# Altium schematic sheet tie-il34-il07-mid.SchDoc: Copper Suicide - Net Tie 34:07:M
size Letter; CheckedBy: E. Chiu; CompanyName: Signal Laboratories, Inc.; DrawnBy: J. Brinton; Engineer: J. Brinton; Address1: 3479 Edison Way; Address2: Menlo Park CA 94025; Address3: +1 (877) 778-8435; Address4: siglabs.com; Revision: 1; SheetNumber: 29; SheetTotal: 47
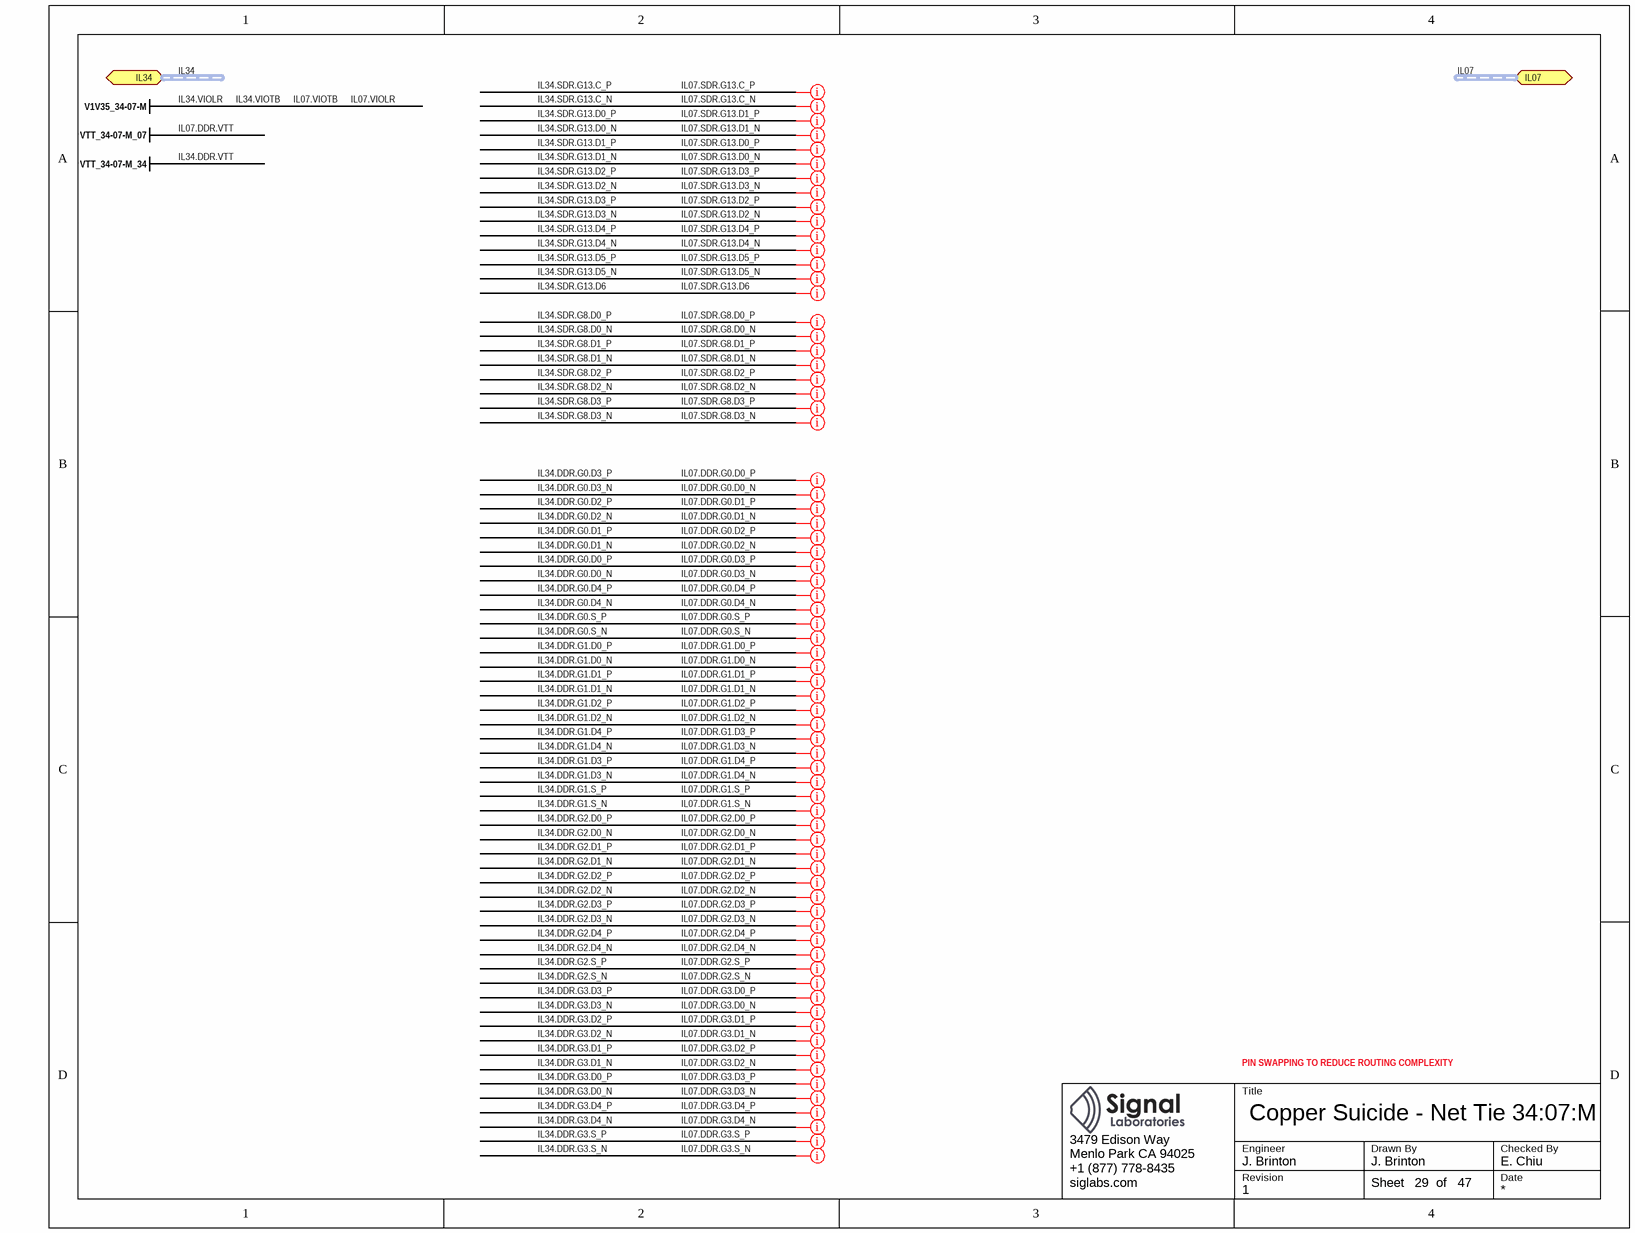
[diagram p0: tie-il34-il07-mid.SchDoc]

## Ports
IL07 (harness IL-1V35), IL34 (harness IL-1V35)

## Buses and harness runs
harness IL07 = port IL07
harness IL34 = port IL34

## Layout directives
net class z50: IL07.SDR.G13.D6
net class z50; differential pair; net class loose: IL07.DDR.G0.D0_N, IL07.DDR.G0.D0_P, IL07.DDR.G0.D1_N, IL07.DDR.G0.D1_P, IL07.DDR.G0.D2_N, IL07.DDR.G0.D2_P, IL07.DDR.G0.D3_N, IL07.DDR.G0.D3_P, IL07.DDR.G0.D4_N, IL07.DDR.G0.D4_P, IL07.DDR.G0.S_N, IL07.DDR.G0.S_P, IL07.DDR.G1.D0_N, IL07.DDR.G1.D0_P, IL07.DDR.G1.D1_N, IL07.DDR.G1.D1_P, IL07.DDR.G1.D2_N, IL07.DDR.G1.D2_P, IL07.DDR.G1.D3_N, IL07.DDR.G1.D3_P, IL07.DDR.G1.D4_N, IL07.DDR.G1.D4_P, IL07.DDR.G1.S_N, IL07.DDR.G1.S_P, IL07.DDR.G2.D0_N, IL07.DDR.G2.D0_P, IL07.DDR.G2.D1_N, IL07.DDR.G2.D1_P, IL07.DDR.G2.D2_N, IL07.DDR.G2.D2_P, IL07.DDR.G2.D3_N, IL07.DDR.G2.D3_P, IL07.DDR.G2.D4_N, IL07.DDR.G2.D4_P, IL07.DDR.G2.S_N, IL07.DDR.G2.S_P, IL07.DDR.G3.D0_N, IL07.DDR.G3.D0_P, IL07.DDR.G3.D1_N, IL07.DDR.G3.D1_P, IL07.DDR.G3.D2_N, IL07.DDR.G3.D2_P, IL07.DDR.G3.D3_N, IL07.DDR.G3.D3_P, IL07.DDR.G3.D4_N, IL07.DDR.G3.D4_P, IL07.DDR.G3.S_N, IL07.DDR.G3.S_P, IL07.SDR.G8.D0_N, IL07.SDR.G8.D0_P, IL07.SDR.G8.D1_N, IL07.SDR.G8.D1_P, IL07.SDR.G8.D2_N, IL07.SDR.G8.D2_P, IL07.SDR.G8.D3_N, IL07.SDR.G8.D3_P, IL07.SDR.G13.C_N, IL07.SDR.G13.C_P, IL07.SDR.G13.D0_N, IL07.SDR.G13.D0_P, IL07.SDR.G13.D1_N, IL07.SDR.G13.D1_P, IL07.SDR.G13.D2_N, IL07.SDR.G13.D2_P, IL07.SDR.G13.D3_N, IL07.SDR.G13.D3_P, IL07.SDR.G13.D4_N, IL07.SDR.G13.D4_P, IL07.SDR.G13.D5_N, IL07.SDR.G13.D5_P

## Notes on the sheet
- PIN SWAPPING TO REDUCE ROUTING COMPLEXITY
- Title
- Engineer
- Revision
- Drawn By
- Checked By
- Date
- Sheet
- of